# EAGLE design Dual_supply_adi (EAGLE 9.6.2)
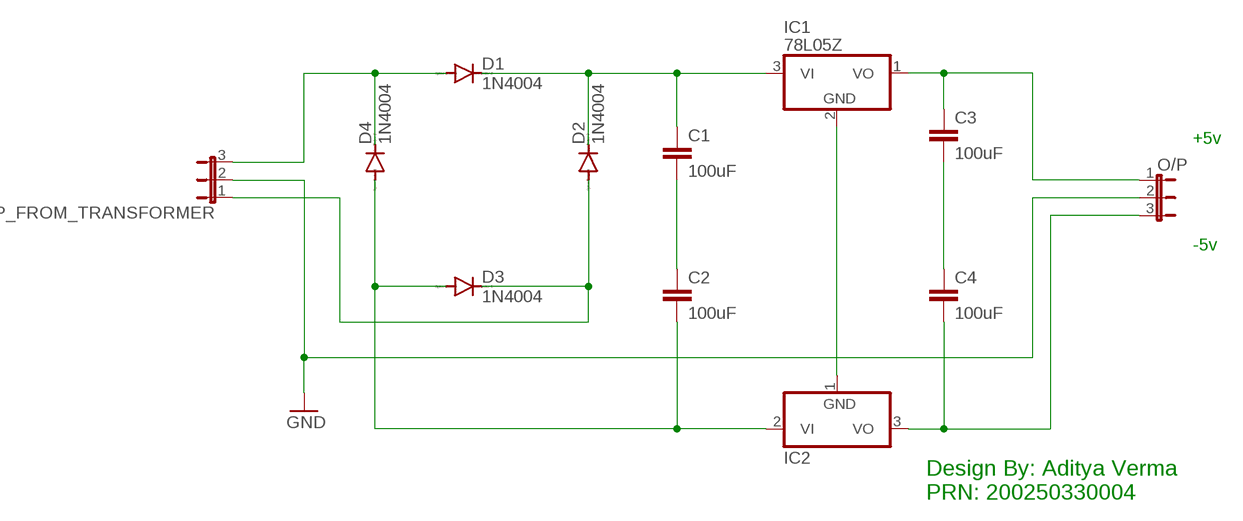
[diagram p0: schematic, sheet 1]

## Parts
C1  100uF  C2,5-3  [C2.5-3]
C2  100uF  C2,5-3  [C2.5-3]
C3  100uF  C2,5-3  [C2.5-3]
C4  100uF  C2,5-3  [C2.5-3]
D1  1N4004  [DO41-10]
D2  1N4004  [DO41-10]
D3  1N4004  [DO41-10]
D4  1N4004  [DO41-10]
I/P_FROM_TRANSFORMER  JP2E  [JP2]
IC1  78L05Z  [TO92]
IC2  79L05Z  [TO92]
O/P  JP2E  [JP2]

## Nets
GND: I/P_FROM_TRANSFORMER.2 O/P.2
N$1: C2.2 D3.A D4.A IC2.2(VI)
N$2: IC1.2(GND) IC2.1(GND)
N$3: C4.2 IC2.3(VO) O/P.3
N$4: D1.A D4.C I/P_FROM_TRANSFORMER.3
N$5: C1.1 D1.C D2.C IC1.3(VI)
N$6: D2.A D3.C I/P_FROM_TRANSFORMER.1
N$7: C3.2 C4.1
N$8: C1.2 C2.1
N$10: C3.1 IC1.1(VO) O/P.1

## Notes on the sheet
- +5v
- -5v
- Design By: Aditya Verma
  PRN: 200250330004

## Library data of the parts
C1-C4 = capacitor-wima:C: CAPACITOR naming: grid - package width
D1-D4 = diode:1N4004: DIODE general purpose rectifier, 1 A
I/P_FROM_TRANSFORMER O/P = jumper:JP2E: JUMPER
IC1 = linear:78*: Positive VOLTAGE REGULATOR Source: http://cache.national.com/ds/LM/LM78L05.pdf http://www.fairchildsemi.com/ds/LM/LM7805.pdf
IC2 = linear:79*: Negative VOLTAGE REGULATOR

## Board
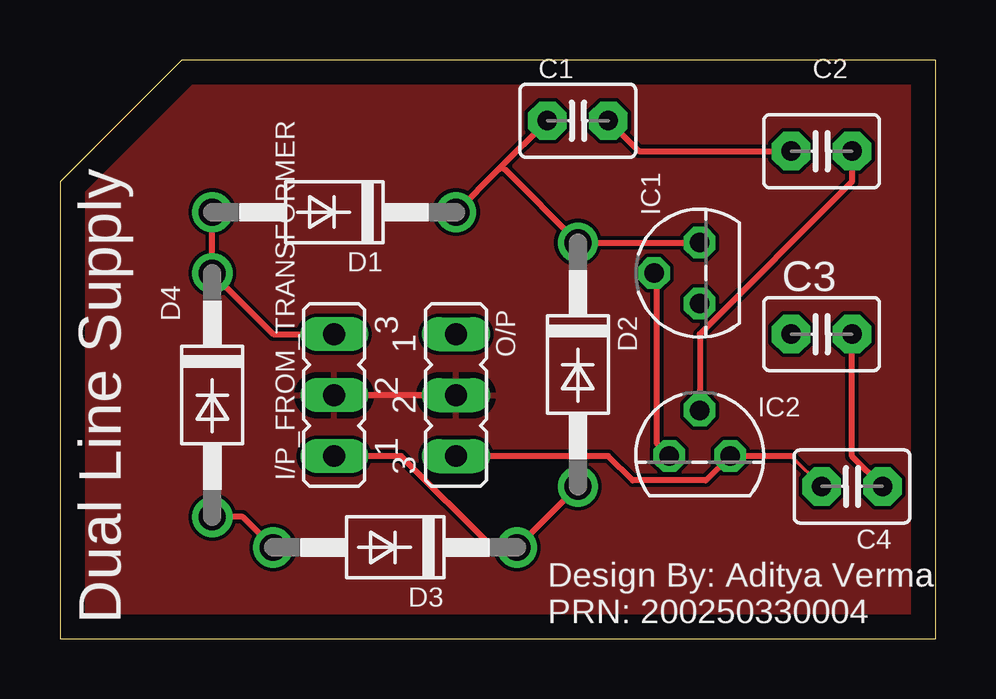
[diagram p1: board, top side]
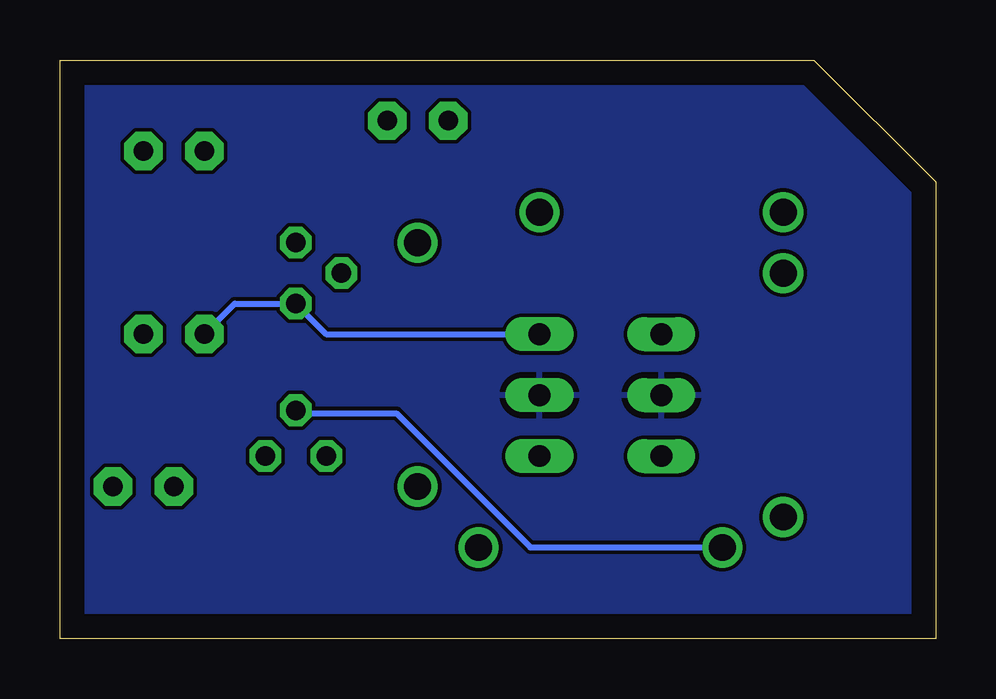
[diagram p2: board, bottom side, seen from below]

Size 36.5 x 24.12 mm. Coordinates in mm from the lower left corner, seen from the top.
Outline: 0,0 36.5,0 36.5,24.12 5.07,24.12 0,19.05 0,0
Copper layers (1*16): Top 0.035mm / dielectric 1.5mm / Bottom 0.035mm
Design rules "default": minimum track width 6mil, minimum drill 0.35mm, track to track 6mil, track to pad 6mil, pad to pad 6mil, via to via 6mil, smd to smd 6mil, copper to edge 40mil, drill to drill 6mil, minimum pad ring 10mil, minimum via ring 8mil, stop-mask expansion 4mil, vias tented up to drill 0mil, thermal gap 10mil

### Footprints (pad centres in the part's own frame; a part is rotated, then mirrored left to right if it is on the bottom)
C2.5-3 = drill 0.813 pad 1.6 octagon: 1 -1.27,0; 2 1.27,0
DO41-10 = drill 1.118: A 5.08,0; C -5.08,0
JP2 = drill 0.914 long: 1 -2.54,0; 2 0,0; 3 2.54,0
TO92 = drill 0.813 octagon: 1 -1.27,0; 2 0,1.905; 3 1.27,0

### Placement (x,y rotation side)
C1  21.59,21.59 0 top
C2  31.75,20.32 0 top
C3  31.75,12.7 0 top
C4  33.02,6.35 180 top
D1  11.43,17.78 180 top
D2  21.59,11.43 270 top
D3  13.97,3.81 180 top
D4  6.35,10.16 270 top
I/P_FROM_TRANSFORMER  11.43,10.16 90 top
IC1  26.67,15.24 90 top
IC2  26.67,7.62 0 top
O/P  16.51,10.16 270 top

### Tracks (layer width: path | path; a pad name or v marks a point on that pad's centre or on a via)
GND
  Top 0.254: O/P.2 I/P_FROM_TRANSFORMER.2
  pour Top: -0.64,19.05 -0.64,-0.64 36.83,-0.64 36.83,24.77 5.08,24.77
  pour Bottom: -1.27,19.05 -1.27,-1.27 37.47,-1.27 37.47,25.4 4.45,25.4 -1.27,19.68
N$1
  Top 0.152: 26.67,9.65 IC2.2
  Top 0.254: D4.A 7.62,5.08 D3.A | 26.67,9.65 26.67,12.7 33.02,19.05 C2.2
  Bottom 0.152: 26.67,9.4 IC2.2
  Bottom 0.254: D3.A 16.89,3.81 22.48,9.4 26.67,9.4
N$2
  Top 0.152: 24.89,15.24 IC1.2
  Top 0.254: 24.89,15.24 24.89,8.13 IC2.1
N$3
  Top 0.152: C4.2 30.48,7.62
  Top 0.254: 30.48,7.62 IC2.3 26.92,6.6 23.88,6.6 22.86,7.62 O/P.3
N$4
  Top 0.254: I/P_FROM_TRANSFORMER.3 8.89,12.7 D4.C D1.A
N$5
  Top 0.152: 18.29,19.56 18.54,19.56
  Top 0.254: IC1.3 D2.C 18.54,19.56 | D1.C 18.29,19.56 C1.1
N$6
  Top 0.152: D3.C 18.03,3.81
  Top 0.254: I/P_FROM_TRANSFORMER.1 14.22,7.62 18.03,3.81 | D3.C D2.A
N$7
  Top 0.254: C3.2 33.02,7.62 C4.1
N$8
  Top 0.254: C2.1 24.13,20.32 C1.2
N$10
  Bottom 0.254: C3.1 29.21,13.97 IC1.1 25.4,12.7 O/P.1

### Text on the board
tPlace: Dual Line Supply
tNames: Design By: Aditya Verma / PRN: 200250330004